# EAGLE design Kona (EAGLE 9.6.2)
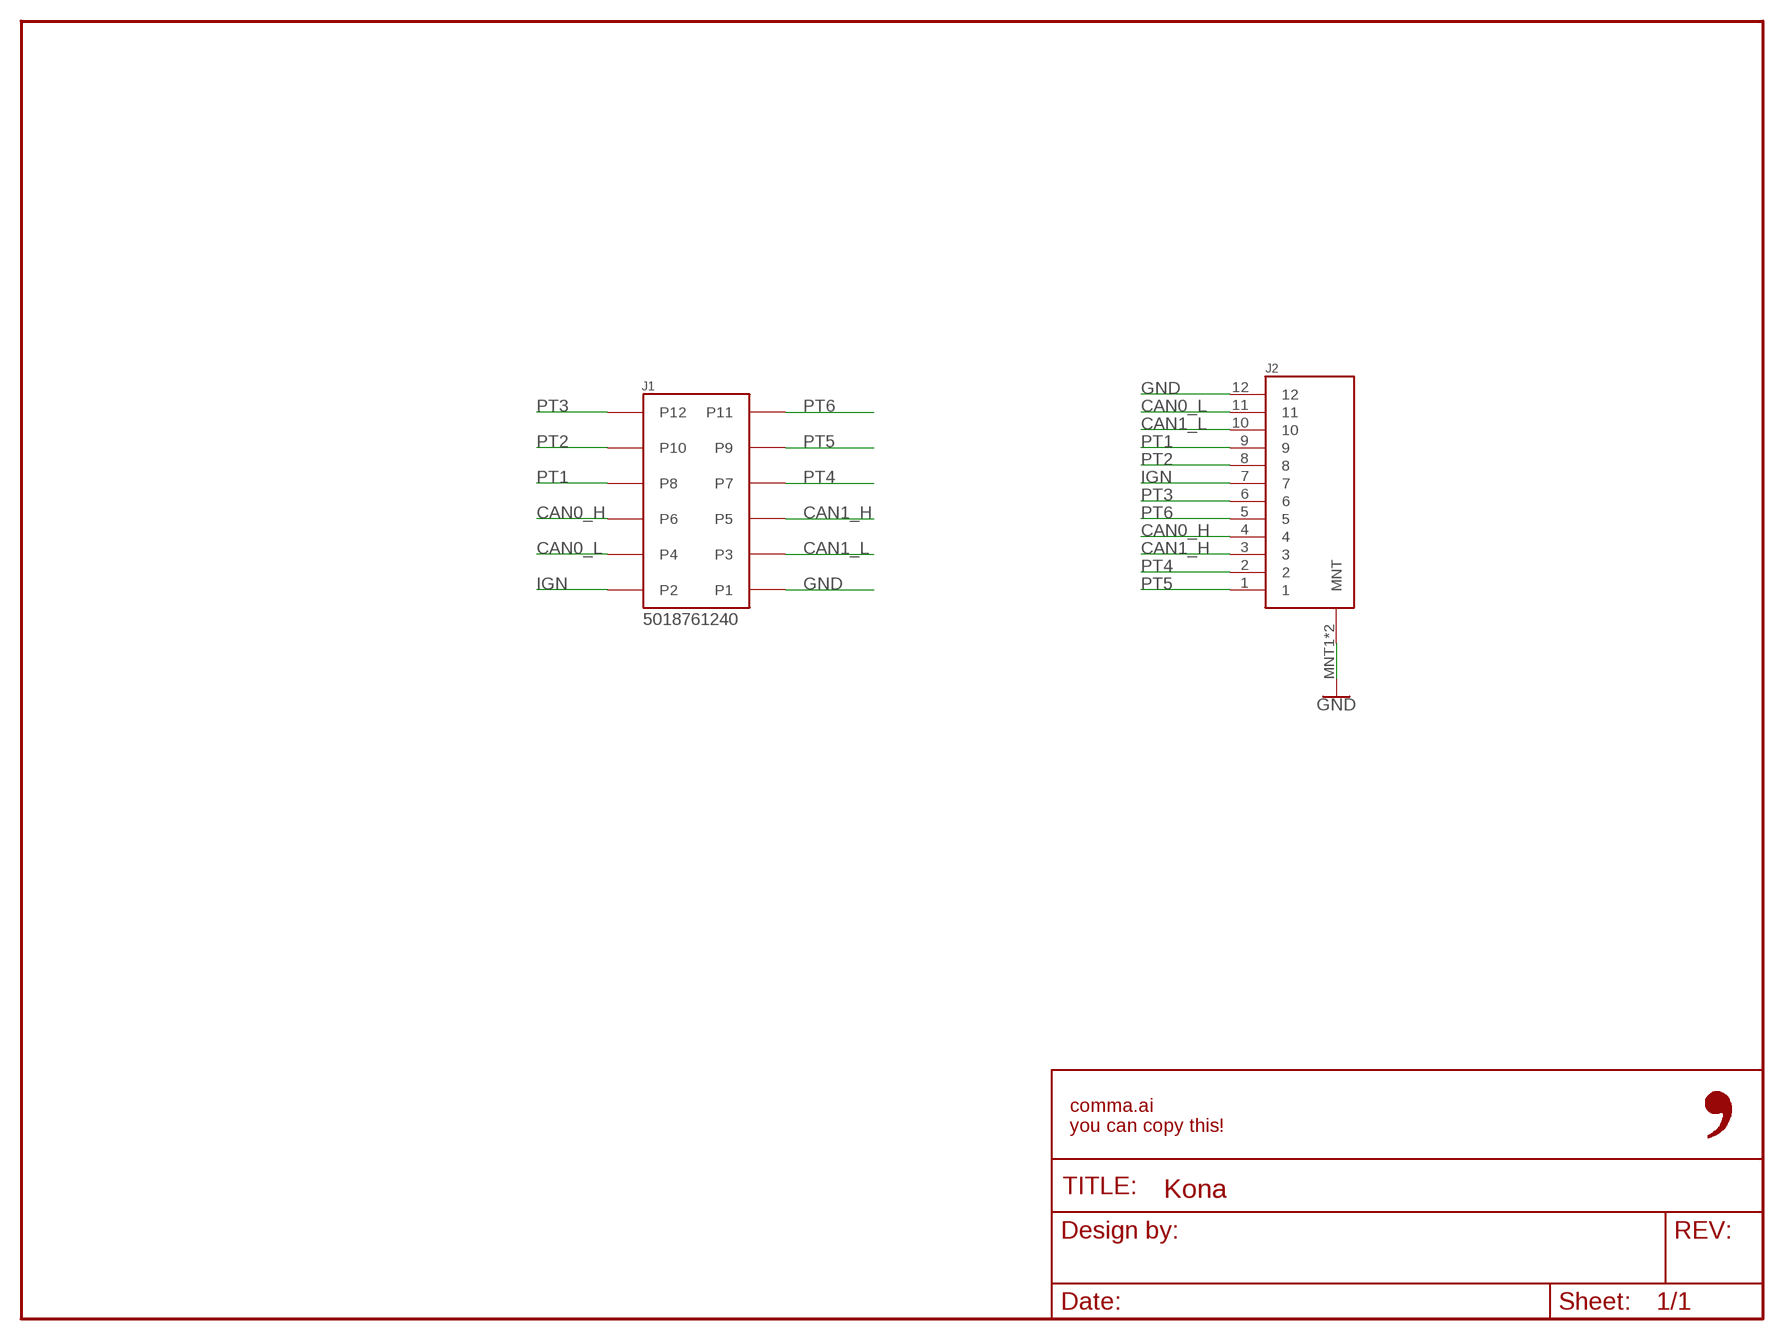
[diagram p0: schematic, sheet 1]

## Parts
FRAME1  FRAME-LETTER-OPENNO_PACKAGE  [DUMMY]
J1  5018761240  [5018761240]
J2  MG646151  [MG646151]

## Nets
CAN0_H: J1.P6 J2.4
CAN0_L: J1.P4 J2.11
CAN1_H: J1.P5 J2.3
CAN1_L: J1.P3 J2.10
GND: J1.P1 J2.12 J2.MNT1(MNT) J2.MNT2(MNT)
IGN: J1.P2 J2.7
PT1: J1.P8 J2.9
PT2: J1.P10 J2.8
PT3: J1.P12 J2.6
PT4: J1.P7 J2.2
PT5: J1.P9 J2.1
PT6: J1.P11 J2.5

## Notes on the sheet
- 5018761240

## Library data of the parts
FRAME1 = comma.ai:FRAME-LETTER-OPEN: Schematic Frame - Letter Standard 8.5x11 US Letter frame; DESIGNER: Nobody; VERSION: v01
J1 = 5018761440:5018761240; CPN: CAI-HARNESS-MOLEX-5018761240; MPN: 5018761240
J2 = comma.ai:MG646151; CPN: CAI-HARNESS-KET-MG646151-5; MPN: MG646151-5

## Board
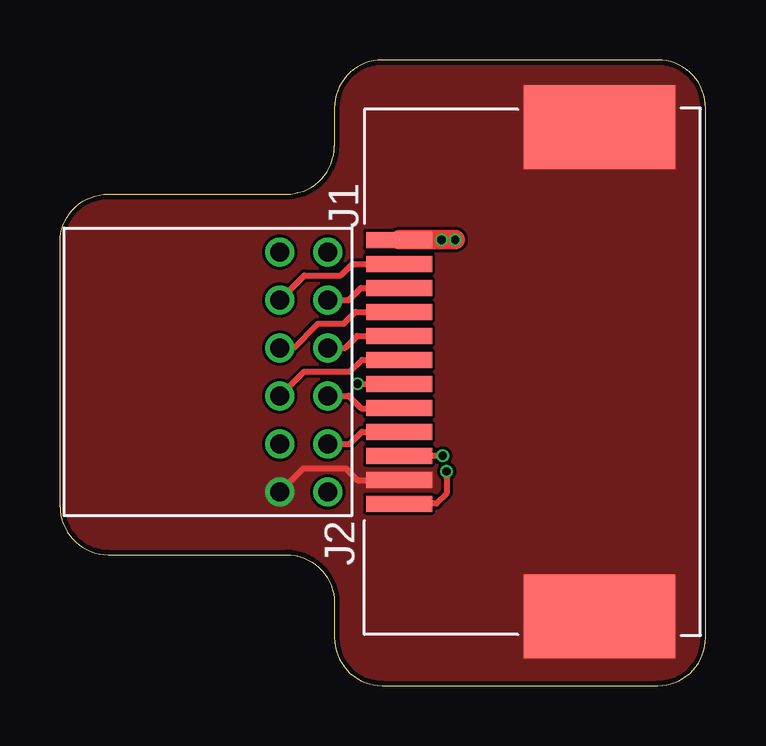
[diagram p1: board, top side]
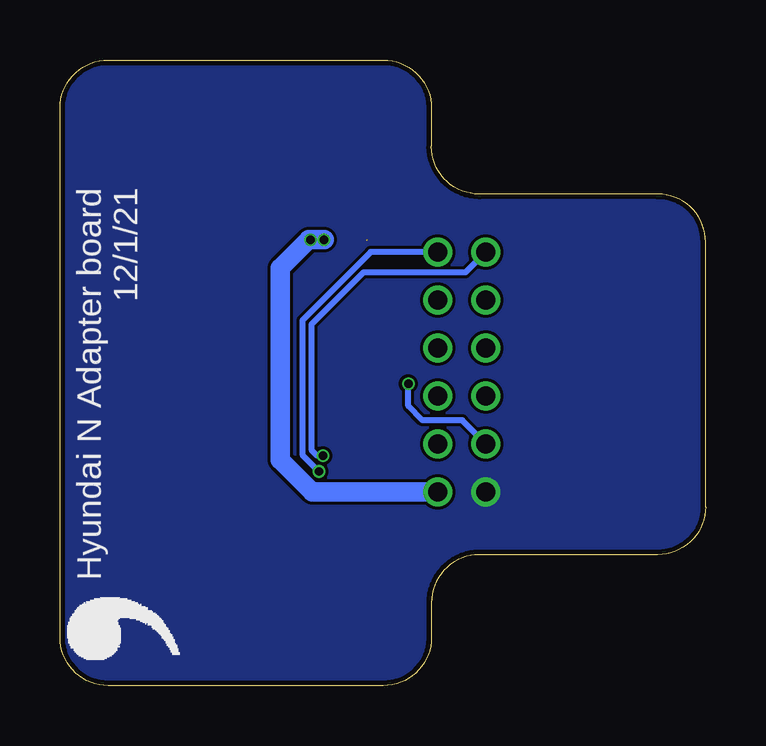
[diagram p2: board, bottom side, seen from below]

Size 26.9 x 26.09 mm. Coordinates in mm from the lower left corner, seen from the top.
Outline: 24.9,0 arc90 26.9,2 26.9,24.09 arc90 24.9,26.09 13.43,26.09 arc90 11.43,24.09 11.43,22.49 arc-90 9.43,20.49 2,20.49 arc90 0,18.49 0,7.46 arc90 2,5.46 9.43,5.46 arc-90 11.43,3.46 11.43,2 arc90 13.43,0 24.9,0
Copper layers (1*16): Top 0.035mm / dielectric 1.5mm / Bottom 0.035mm
Design rules "jlcpcb_2layer": minimum track width 5mil, minimum drill 12mil, track to track 5mil, track to pad 5mil, pad to pad 5mil, via to via 5mil, smd to smd 5mil, copper to edge 8mil, drill to drill 8mil, minimum pad ring 3mil, minimum via ring 3mil, stop-mask expansion 4mm, vias tented up to drill 20mil, thermal gap 10mil

### Footprints (pad centres in the part's own frame; a part is rotated, then mirrored left to right if it is on the bottom)
5018761240 = drill 0.8: P1 5,-1; P2 5,1; P3 3,-1; P4 3,1; P5 1,-1; P6 1,1; P7 -1,-1; P8 -1,1; P9 -3,-1; P10 -3,1; P11 -5,-1; P12 -5,1
MG646151 = smd 0.66 x 2.75: 1 4.5,8.35; 2 2.5,8.35; 3 0.5,8.35; 4 -1.5,8.35; 5 -3.5,8.35; 6 -5.5,8.35; 7 5.5,8.35; 8 3.5,8.35; 9 1.5,8.35; 10 -0.5,8.35; 11 -2.5,8.35; 12 -4.5,8.35 | smd 3.5 x 6.3: MNT1 -10.2,0; MNT2 10.2,0

### Placement (x,y rotation side)
FRAME1  -13.97,27.05 0 top  (outside the outline)
J1  10.16,13.08 270 top
J2  22.48,13.08 90 top
U$1  [LOGO]  21.62,0.4 90 bottom

### Tracks (layer width: path | path; a pad name or v marks a point on that pad's centre or on a via)
CAN0_H
  Top 0.254: J1.P6 12.03,12.08 12.55,11.56 14.11,11.56 J2.4
CAN0_L
  Top 0.254: J1.P4 12.08,10.08 12.58,10.58 J2.11
CAN1_H
  Top 0.254: J1.P5 10.17,13.09 12.1,13.09 12.59,13.58 J2.3
CAN1_L  (via drill 0.35)
  Top 0.254: v12.39,12.58 J2.10
  Bottom 0.254: J1.P3 10.14,11.06 11.8,11.06 12.39,11.65 v12.39,12.58
GND
  Top 0.254: J1.P1 10.13,9.05 11.91,9.05 12.4,8.56 14.11,8.56 J2.12
  pour Top (no thermals): 27.94,27.05 -3.81,27.05 -3.81,-2.09 27.94,-2.09
  pour Bottom (no thermals): -2.54,28.32 -2.54,-0.62 29.21,-0.62 29.21,28.32
IGN  (via drill 0.35)  (1 unrouted)
  Top 0.813: J2.7 v16.47,18.59
  Bottom 0.813: J1.P2 16.39,8.08 17.72,9.41 17.72,17.4 16.53,18.59 v16.47,18.59 v15.9,18.59
PT1
  Top 0.254: J1.P8 11.88,14.08 12.38,14.58 J2.9
PT2
  Top 0.254: J1.P10 12.04,16.08 12.54,16.58 J2.8
PT3  (via drill 0.35)
  Top 0.254: v16.11,8.93 16.11,8.02 15.68,7.59 J2.6
  Bottom 0.254: J1.P12 13.96,18.08 16.81,15.23 16.81,9.63 v16.11,8.93
PT4
  Top 0.254: J1.P7 9.73,14.08 10.74,15.09 11.82,15.09 12.31,15.58 J2.2
PT5
  Top 0.254: J1.P9 10.18,17.1 11.7,17.1 12.18,17.58 J2.1
PT6  (via drill 0.35)
  Top 0.254: v15.95,9.58 J2.5
  Bottom 0.254: J1.P11 10.01,17.23 14.26,17.23 16.43,15.06 16.43,9.83 16.18,9.58 v15.95,9.58

### Text on the board
bNames: Hyundai N Adapter board / 12/1/21